# EAGLE schematic tdlf_08_15_2021_server_top (EAGLE 9.6.2)
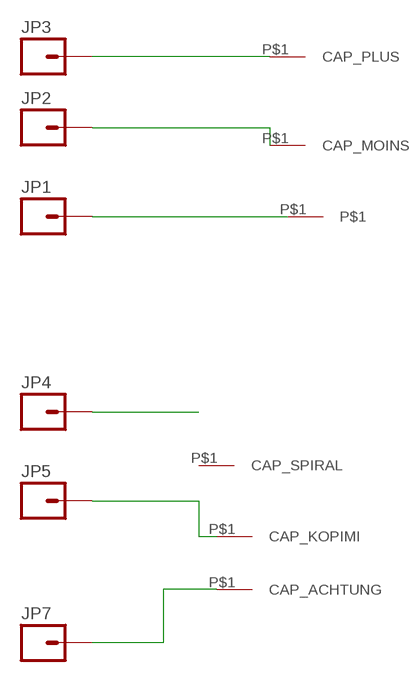
[diagram p0: schematic, sheet 1]

## Parts
CAP_MUSH  MUSH  TDLF_CAP_02  [TDLF_CAP_02]
CAP_PLUS  TDLF_CAP_PLUS  [TDLF_CAP_PLUS]
JP1  M01SMD  [LUXEON-PAD]
JP2  M01SMD  [LUXEON-PAD]
JP3  M01SMD  [LUXEON-PAD]
JP4  M01SMD  [LUXEON-PAD]
JP5  M01SMD  [LUXEON-PAD]
JP7  M01SMD  [LUXEON-PAD]
U$1  TDLF_CAP_MOINS  [TDLF_CAP_MOINS]
U$2  TDLF_CAP_SPIRAL  [TDLF_CAP_SPIRAL]
U$3  TDLF_CAP_KOPIMI  [TDLF_CAP_KOPIMI]
U$4  TDLF_CAP_ACHTUNG  [TDLF_CAP_ACHTUNG]

## Nets
CHAMPI: CAP_MUSH.P$1 JP1.P$1
KOPIMI: JP5.P$1 U$3.P$1(CAP_KOPIMI)
MOINS: JP2.P$1 U$1.P$1(CAP_MOINS)
N$1: JP7.P$1 U$4.P$1(CAP_ACHTUNG)
PLUS: CAP_PLUS.P$1(CAP_PLUS) JP3.P$1
SPIRAL: JP4.P$1
Unconnected: U$2.P$1(CAP_SPIRAL)

## Library data of the parts
CAP_MUSH = alx_lib:TDLF_CAP_02: Mushroom capacitive button
CAP_PLUS = alx_lib:TDLF_CAP_PLUS: Capacitive plus button
JP1-JP5 JP7 = SparkFun-Connectors:M01: Header 1 Standard 1-pin 0.1" header. Use with straight break away headers (SKU : PRT-00116), right angle break away headers (PRT-00553), swiss pins (PRT-00743), machine pins (PRT-00117), and female headers (PRT-00115).
U$1 = alx_lib:TDLF_CAP_MOINS
U$2 = alx_lib:TDLF_CAP_SPIRAL
U$3 = alx_lib:TDLF_CAP_KOPIMI: CAPACITIVE TOUCH BUTTON KOPIMI
U$4 = alx_lib:TDLF_CAP_ACHTUNG: CAPACITIVER TOUCH BUTTON ACHTUNG